# EAGLE schematic Led_panel_v2.0 (EAGLE 9.5.2)
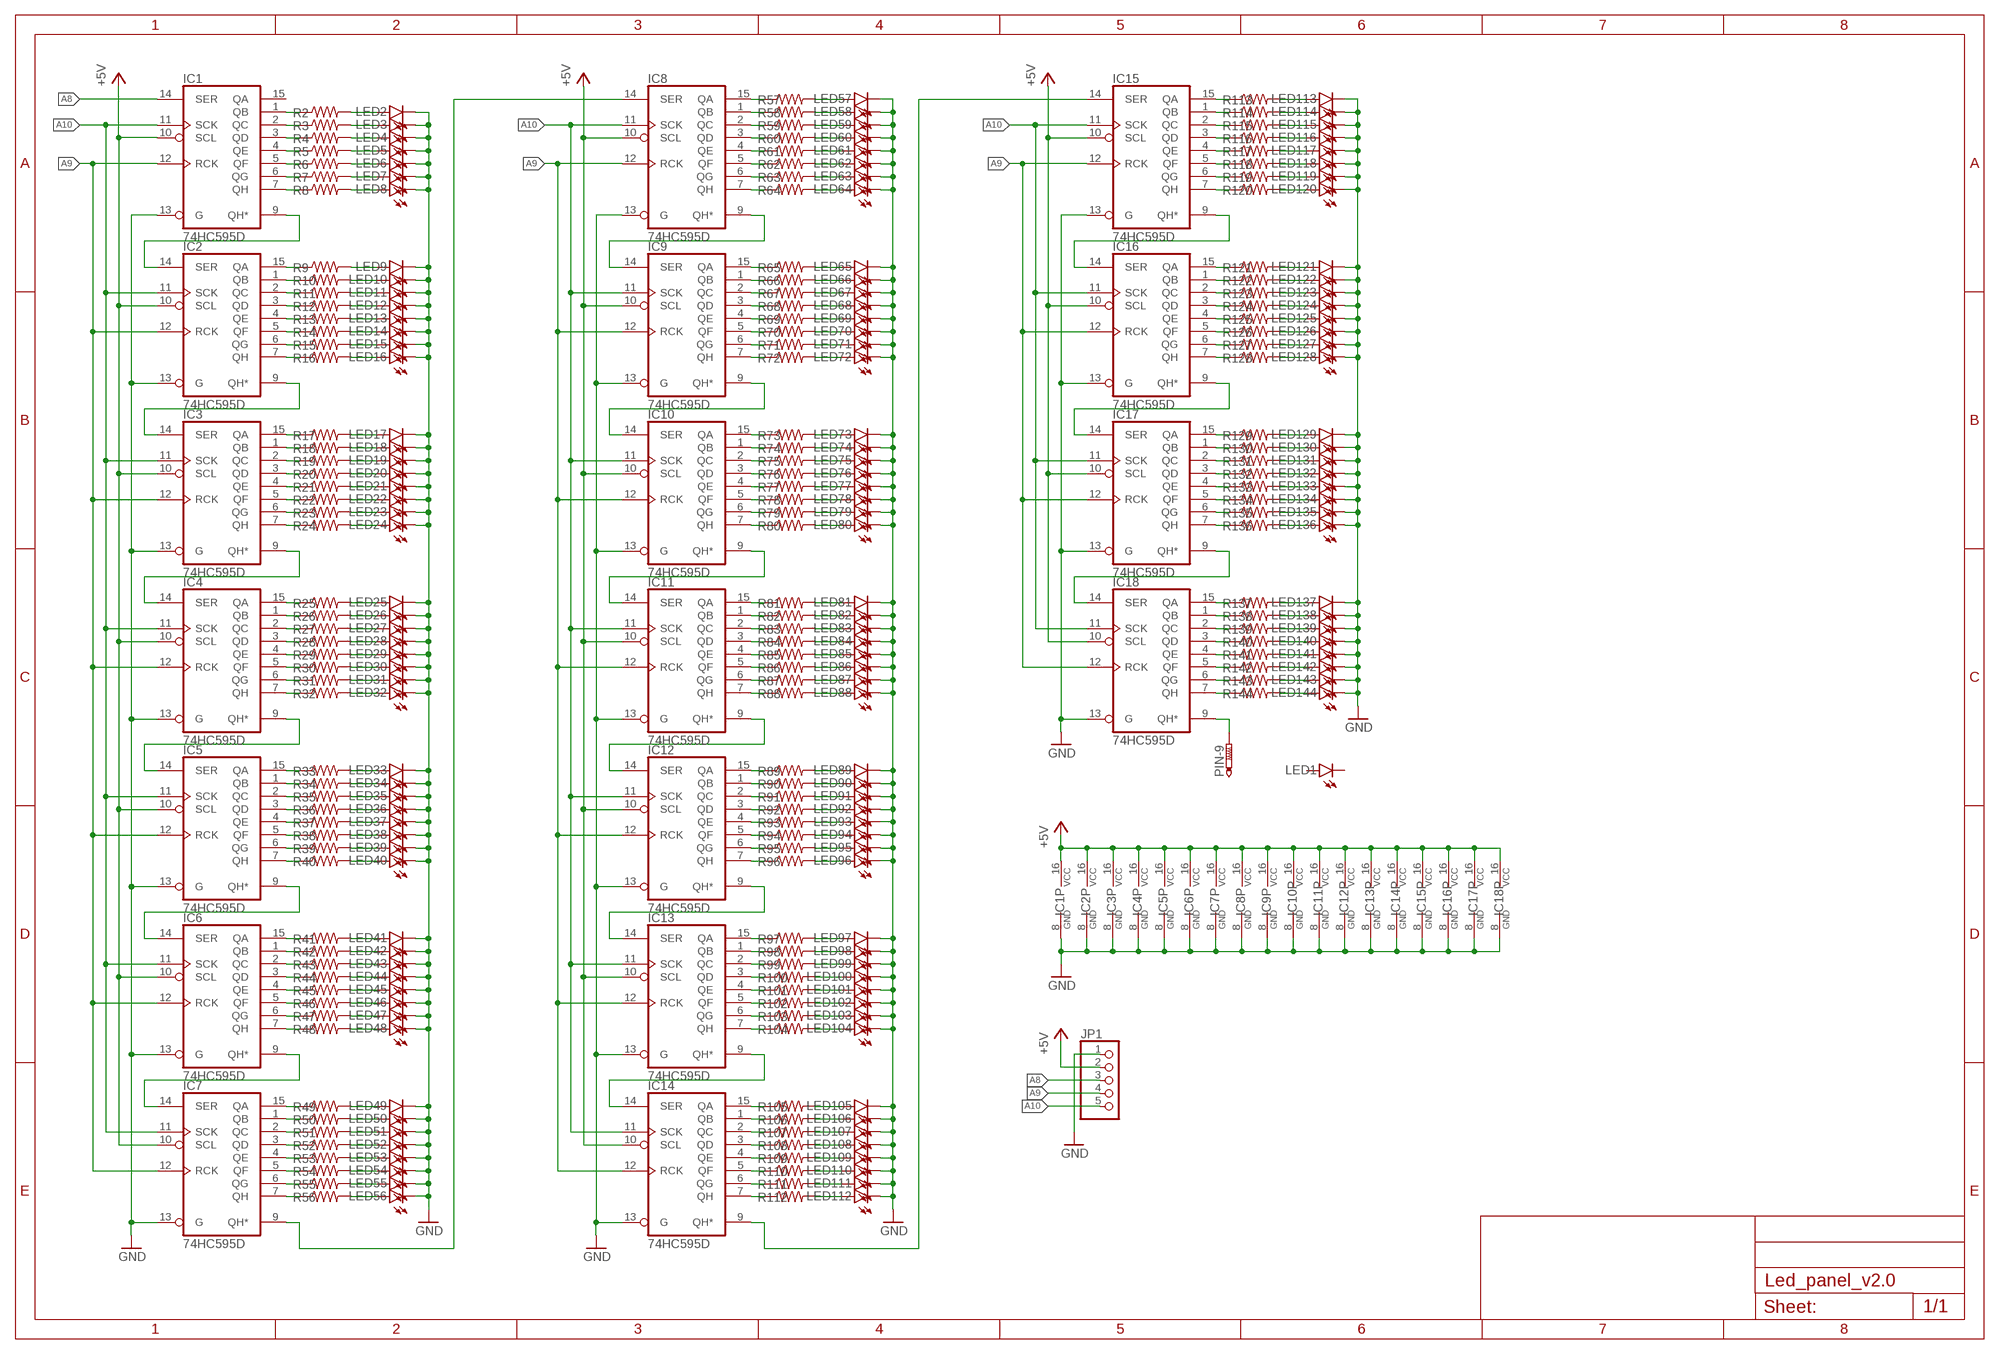
[diagram p0: schematic, sheet 1]

## Parts
IC1  74HC595D  [SO16]
IC2  74HC595D  [SO16]
IC3  74HC595D  [SO16]
IC4  74HC595D  [SO16]
IC5  74HC595D  [SO16]
IC6  74HC595D  [SO16]
IC7  74HC595D  [SO16]
IC8  74HC595D  [SO16]
IC9  74HC595D  [SO16]
IC10  74HC595D  [SO16]
IC11  74HC595D  [SO16]
IC12  74HC595D  [SO16]
IC13  74HC595D  [SO16]
IC14  74HC595D  [SO16]
IC15  74HC595D  [SO16]
IC16  74HC595D  [SO16]
IC17  74HC595D  [SO16]
IC18  74HC595D  [SO16]
JP1  PINHD-1X5  [1X05]
LED1  LED3MM  [LED3MM]
LED2  LED3MM  [LED3MM]
LED3  LED3MM  [LED3MM]
LED4  LED3MM  [LED3MM]
LED5  LED3MM  [LED3MM]
LED6  LED3MM  [LED3MM]
LED7  LED3MM  [LED3MM]
LED8  LED3MM  [LED3MM]
LED9  LED3MM  [LED3MM]
LED10  LED3MM  [LED3MM]
LED11  LED3MM  [LED3MM]
LED12  LED3MM  [LED3MM]
LED13  LED3MM  [LED3MM]
LED14  LED3MM  [LED3MM]
LED15  LED3MM  [LED3MM]
LED16  LED3MM  [LED3MM]
LED17  LED3MM  [LED3MM]
LED18  LED3MM  [LED3MM]
LED19  LED3MM  [LED3MM]
LED20  LED3MM  [LED3MM]
LED21  LED3MM  [LED3MM]
LED22  LED3MM  [LED3MM]
LED23  LED3MM  [LED3MM]
LED24  LED3MM  [LED3MM]
LED25  LED3MM  [LED3MM]
LED26  LED3MM  [LED3MM]
LED27  LED3MM  [LED3MM]
LED28  LED3MM  [LED3MM]
LED29  LED3MM  [LED3MM]
LED30  LED3MM  [LED3MM]
LED31  LED3MM  [LED3MM]
LED32  LED3MM  [LED3MM]
LED33  LED3MM  [LED3MM]
LED34  LED3MM  [LED3MM]
LED35  LED3MM  [LED3MM]
LED36  LED3MM  [LED3MM]
LED37  LED3MM  [LED3MM]
LED38  LED3MM  [LED3MM]
LED39  LED3MM  [LED3MM]
LED40  LED3MM  [LED3MM]
LED41  LED3MM  [LED3MM]
LED42  LED3MM  [LED3MM]
LED43  LED3MM  [LED3MM]
LED44  LED3MM  [LED3MM]
LED45  LED3MM  [LED3MM]
LED46  LED3MM  [LED3MM]
LED47  LED3MM  [LED3MM]
LED48  LED3MM  [LED3MM]
LED49  LED3MM  [LED3MM]
LED50  LED3MM  [LED3MM]
LED51  LED3MM  [LED3MM]
LED52  LED3MM  [LED3MM]
LED53  LED3MM  [LED3MM]
LED54  LED3MM  [LED3MM]
LED55  LED3MM  [LED3MM]
LED56  LED3MM  [LED3MM]
LED57  LED3MM  [LED3MM]
LED58  LED3MM  [LED3MM]
LED59  LED3MM  [LED3MM]
LED60  LED3MM  [LED3MM]
LED61  LED3MM  [LED3MM]
LED62  LED3MM  [LED3MM]
LED63  LED3MM  [LED3MM]
LED64  LED3MM  [LED3MM]
LED65  LED3MM  [LED3MM]
LED66  LED3MM  [LED3MM]
LED67  LED3MM  [LED3MM]
LED68  LED3MM  [LED3MM]
LED69  LED3MM  [LED3MM]
LED70  LED3MM  [LED3MM]
LED71  LED3MM  [LED3MM]
LED72  LED3MM  [LED3MM]
LED73  LED3MM  [LED3MM]
LED74  LED3MM  [LED3MM]
LED75  LED3MM  [LED3MM]
LED76  LED3MM  [LED3MM]
LED77  LED3MM  [LED3MM]
LED78  LED3MM  [LED3MM]
LED79  LED3MM  [LED3MM]
LED80  LED3MM  [LED3MM]
LED81  LED3MM  [LED3MM]
LED82  LED3MM  [LED3MM]
LED83  LED3MM  [LED3MM]
LED84  LED3MM  [LED3MM]
LED85  LED3MM  [LED3MM]
LED86  LED3MM  [LED3MM]
LED87  LED3MM  [LED3MM]
LED88  LED3MM  [LED3MM]
LED89  LED3MM  [LED3MM]
LED90  LED3MM  [LED3MM]
LED91  LED3MM  [LED3MM]
LED92  LED3MM  [LED3MM]
LED93  LED3MM  [LED3MM]
LED94  LED3MM  [LED3MM]
LED95  LED3MM  [LED3MM]
LED96  LED3MM  [LED3MM]
LED97  LED3MM  [LED3MM]
LED98  LED3MM  [LED3MM]
LED99  LED3MM  [LED3MM]
LED100  LED3MM  [LED3MM]
LED101  LED3MM  [LED3MM]
LED102  LED3MM  [LED3MM]
LED103  LED3MM  [LED3MM]
LED104  LED3MM  [LED3MM]
LED105  LED3MM  [LED3MM]
LED106  LED3MM  [LED3MM]
LED107  LED3MM  [LED3MM]
LED108  LED3MM  [LED3MM]
LED109  LED3MM  [LED3MM]
LED110  LED3MM  [LED3MM]
LED111  LED3MM  [LED3MM]
LED112  LED3MM  [LED3MM]
LED113  LED3MM  [LED3MM]
LED114  LED3MM  [LED3MM]
LED115  LED3MM  [LED3MM]
LED116  LED3MM  [LED3MM]
LED117  LED3MM  [LED3MM]
LED118  LED3MM  [LED3MM]
LED119  LED3MM  [LED3MM]
LED120  LED3MM  [LED3MM]
LED121  LED3MM  [LED3MM]
LED122  LED3MM  [LED3MM]
LED123  LED3MM  [LED3MM]
LED124  LED3MM  [LED3MM]
LED125  LED3MM  [LED3MM]
LED126  LED3MM  [LED3MM]
LED127  LED3MM  [LED3MM]
LED128  LED3MM  [LED3MM]
LED129  LED3MM  [LED3MM]
LED130  LED3MM  [LED3MM]
LED131  LED3MM  [LED3MM]
LED132  LED3MM  [LED3MM]
LED133  LED3MM  [LED3MM]
LED134  LED3MM  [LED3MM]
LED135  LED3MM  [LED3MM]
LED136  LED3MM  [LED3MM]
LED137  LED3MM  [LED3MM]
LED138  LED3MM  [LED3MM]
LED139  LED3MM  [LED3MM]
LED140  LED3MM  [LED3MM]
LED141  LED3MM  [LED3MM]
LED142  LED3MM  [LED3MM]
LED143  LED3MM  [LED3MM]
LED144  LED3MM  [LED3MM]
PIN-9  PTR1TP20R  [TP20R]
R2  120R  R-US_R0805  [R0805]
R3  120R  R-US_R0805  [R0805]
R4  120R  R-US_R0805  [R0805]
R5  120R  R-US_R0805  [R0805]
R6  120R  R-US_R0805  [R0805]
R7  120R  R-US_R0805  [R0805]
R8  120R  R-US_R0805  [R0805]
R9  120R  R-US_R0805  [R0805]
R10  120R  R-US_R0805  [R0805]
R11  120R  R-US_R0805  [R0805]
R12  120R  R-US_R0805  [R0805]
R13  120R  R-US_R0805  [R0805]
R14  120R  R-US_R0805  [R0805]
R15  120R  R-US_R0805  [R0805]
R16  120R  R-US_R0805  [R0805]
R17  120R  R-US_R0805  [R0805]
R18  120R  R-US_R0805  [R0805]
R19  120R  R-US_R0805  [R0805]
R20  120R  R-US_R0805  [R0805]
R21  120R  R-US_R0805  [R0805]
R22  120R  R-US_R0805  [R0805]
R23  120R  R-US_R0805  [R0805]
R24  120R  R-US_R0805  [R0805]
R25  120R  R-US_R0805  [R0805]
R26  120R  R-US_R0805  [R0805]
R27  120R  R-US_R0805  [R0805]
R28  120R  R-US_R0805  [R0805]
R29  120R  R-US_R0805  [R0805]
R30  120R  R-US_R0805  [R0805]
R31  120R  R-US_R0805  [R0805]
R32  120R  R-US_R0805  [R0805]
R33  120R  R-US_R0805  [R0805]
R34  120R  R-US_R0805  [R0805]
R35  120R  R-US_R0805  [R0805]
R36  120R  R-US_R0805  [R0805]
R37  120R  R-US_R0805  [R0805]
R38  120R  R-US_R0805  [R0805]
R39  120R  R-US_R0805  [R0805]
R40  120R  R-US_R0805  [R0805]
R41  120R  R-US_R0805  [R0805]
R42  120R  R-US_R0805  [R0805]
R43  120R  R-US_R0805  [R0805]
R44  120R  R-US_R0805  [R0805]
R45  120R  R-US_R0805  [R0805]
R46  120R  R-US_R0805  [R0805]
R47  120R  R-US_R0805  [R0805]
R48  120R  R-US_R0805  [R0805]
R49  120R  R-US_R0805  [R0805]
R50  120R  R-US_R0805  [R0805]
R51  120R  R-US_R0805  [R0805]
R52  120R  R-US_R0805  [R0805]
R53  120R  R-US_R0805  [R0805]
R54  120R  R-US_R0805  [R0805]
R55  120R  R-US_R0805  [R0805]
R56  120R  R-US_R0805  [R0805]
R57  120R  R-US_R0805  [R0805]
R58  120R  R-US_R0805  [R0805]
R59  120R  R-US_R0805  [R0805]
R60  120R  R-US_R0805  [R0805]
R61  120R  R-US_R0805  [R0805]
R62  120R  R-US_R0805  [R0805]
R63  120R  R-US_R0805  [R0805]
R64  120R  R-US_R0805  [R0805]
R65  120R  R-US_R0805  [R0805]
R66  120R  R-US_R0805  [R0805]
R67  120R  R-US_R0805  [R0805]
R68  120R  R-US_R0805  [R0805]
R69  120R  R-US_R0805  [R0805]
R70  120R  R-US_R0805  [R0805]
R71  120R  R-US_R0805  [R0805]
R72  120R  R-US_R0805  [R0805]
R73  120R  R-US_R0805  [R0805]
R74  120R  R-US_R0805  [R0805]
R75  120R  R-US_R0805  [R0805]
R76  120R  R-US_R0805  [R0805]
R77  120R  R-US_R0805  [R0805]
R78  120R  R-US_R0805  [R0805]
R79  120R  R-US_R0805  [R0805]
R80  120R  R-US_R0805  [R0805]
R81  120R  R-US_R0805  [R0805]
R82  120R  R-US_R0805  [R0805]
R83  120R  R-US_R0805  [R0805]
R84  120R  R-US_R0805  [R0805]
R85  120R  R-US_R0805  [R0805]
R86  120R  R-US_R0805  [R0805]
R87  120R  R-US_R0805  [R0805]
R88  120R  R-US_R0805  [R0805]
R89  120R  R-US_R0805  [R0805]
R90  120R  R-US_R0805  [R0805]
R91  120R  R-US_R0805  [R0805]
R92  120R  R-US_R0805  [R0805]
R93  120R  R-US_R0805  [R0805]
R94  120R  R-US_R0805  [R0805]
R95  120R  R-US_R0805  [R0805]
R96  120R  R-US_R0805  [R0805]
R97  120R  R-US_R0805  [R0805]
R98  120R  R-US_R0805  [R0805]
R99  120R  R-US_R0805  [R0805]
R100  120R  R-US_R0805  [R0805]
R101  120R  R-US_R0805  [R0805]
R102  120R  R-US_R0805  [R0805]
R103  120R  R-US_R0805  [R0805]
R104  120R  R-US_R0805  [R0805]
R105  120R  R-US_R0805  [R0805]
R106  120R  R-US_R0805  [R0805]
R107  120R  R-US_R0805  [R0805]
R108  120R  R-US_R0805  [R0805]
R109  120R  R-US_R0805  [R0805]
R110  120R  R-US_R0805  [R0805]
R111  120R  R-US_R0805  [R0805]
R112  120R  R-US_R0805  [R0805]
R113  120R  R-US_R0805  [R0805]
R114  120R  R-US_R0805  [R0805]
R115  120R  R-US_R0805  [R0805]
R116  120R  R-US_R0805  [R0805]
R117  120R  R-US_R0805  [R0805]
R118  120R  R-US_R0805  [R0805]
R119  120R  R-US_R0805  [R0805]
R120  120R  R-US_R0805  [R0805]
R121  120R  R-US_R0805  [R0805]
R122  120R  R-US_R0805  [R0805]
R123  120R  R-US_R0805  [R0805]
R124  120R  R-US_R0805  [R0805]
R125  120R  R-US_R0805  [R0805]
R126  120R  R-US_R0805  [R0805]
R127  120R  R-US_R0805  [R0805]
R128  120R  R-US_R0805  [R0805]
R129  120R  R-US_R0805  [R0805]
R130  120R  R-US_R0805  [R0805]
R131  120R  R-US_R0805  [R0805]
R132  120R  R-US_R0805  [R0805]
R133  120R  R-US_R0805  [R0805]
R134  120R  R-US_R0805  [R0805]
R135  120R  R-US_R0805  [R0805]
R136  120R  R-US_R0805  [R0805]
R137  120R  R-US_R0805  [R0805]
R138  120R  R-US_R0805  [R0805]
R139  120R  R-US_R0805  [R0805]
R140  120R  R-US_R0805  [R0805]
R141  120R  R-US_R0805  [R0805]
R142  120R  R-US_R0805  [R0805]
R143  120R  R-US_R0805  [R0805]
R144  120R  R-US_R0805  [R0805]

## Nets
+5V: IC1.10(SCL) IC1.16(VCC) IC2.10(SCL) IC2.16(VCC) IC3.10(SCL) IC3.16(VCC) IC4.10(SCL) IC4.16(VCC) IC5.10(SCL) IC5.16(VCC) IC6.10(SCL) IC6.16(VCC) IC7.10(SCL) IC7.16(VCC) IC8.10(SCL) IC8.16(VCC) IC9.10(SCL) IC9.16(VCC) IC10.10(SCL) IC10.16(VCC) IC11.10(SCL) IC11.16(VCC) IC12.10(SCL) IC12.16(VCC) IC13.10(SCL) IC13.16(VCC) IC14.10(SCL) IC14.16(VCC) IC15.10(SCL) IC15.16(VCC) IC16.10(SCL) IC16.16(VCC) IC17.10(SCL) IC17.16(VCC) IC18.10(SCL) IC18.16(VCC) JP1.2
A8: IC1.14(SER) JP1.3
A9: IC1.12(RCK) IC2.12(RCK) IC3.12(RCK) IC4.12(RCK) IC5.12(RCK) IC6.12(RCK) IC7.12(RCK) IC8.12(RCK) IC9.12(RCK) IC10.12(RCK) IC11.12(RCK) IC12.12(RCK) IC13.12(RCK) IC14.12(RCK) IC15.12(RCK) IC16.12(RCK) IC17.12(RCK) IC18.12(RCK) JP1.4
A10: IC1.11(SCK) IC2.11(SCK) IC3.11(SCK) IC4.11(SCK) IC5.11(SCK) IC6.11(SCK) IC7.11(SCK) IC8.11(SCK) IC9.11(SCK) IC10.11(SCK) IC11.11(SCK) IC12.11(SCK) IC13.11(SCK) IC14.11(SCK) IC15.11(SCK) IC16.11(SCK) IC17.11(SCK) IC18.11(SCK) JP1.5
GND: IC1.8(GND) IC1.13(G) IC2.8(GND) IC2.13(G) IC3.8(GND) IC3.13(G) IC4.8(GND) IC4.13(G) IC5.8(GND) IC5.13(G) IC6.8(GND) IC6.13(G) IC7.8(GND) IC7.13(G) IC8.8(GND) IC8.13(G) IC9.8(GND) IC9.13(G) IC10.8(GND) IC10.13(G) IC11.8(GND) IC11.13(G) IC12.8(GND) IC12.13(G) IC13.8(GND) IC13.13(G) IC14.8(GND) IC14.13(G) IC15.8(GND) IC15.13(G) IC16.8(GND) IC16.13(G) IC17.8(GND) IC17.13(G) IC18.8(GND) IC18.13(G) JP1.1 LED2.K(C) LED3.K(C) LED4.K(C) LED5.K(C) LED6.K(C) LED7.K(C) LED8.K(C) LED9.K(C) LED10.K(C) LED11.K(C) LED12.K(C) LED13.K(C) LED14.K(C) LED15.K(C) LED16.K(C) LED17.K(C) LED18.K(C) LED19.K(C) LED20.K(C) LED21.K(C) LED22.K(C) LED23.K(C) LED24.K(C) LED25.K(C) LED26.K(C) LED27.K(C) LED28.K(C) LED29.K(C) LED30.K(C) LED31.K(C) LED32.K(C) LED33.K(C) LED34.K(C) LED35.K(C) LED36.K(C) LED37.K(C) LED38.K(C) LED39.K(C) LED40.K(C) LED41.K(C) LED42.K(C) LED43.K(C) LED44.K(C) LED45.K(C) LED46.K(C) LED47.K(C) LED48.K(C) LED49.K(C) LED50.K(C) LED51.K(C) LED52.K(C) LED53.K(C) LED54.K(C) LED55.K(C) LED56.K(C) LED57.K(C) LED58.K(C) LED59.K(C) LED60.K(C) LED61.K(C) LED62.K(C) LED63.K(C) LED64.K(C) LED65.K(C) LED66.K(C) LED67.K(C) LED68.K(C) LED69.K(C) LED70.K(C) LED71.K(C) LED72.K(C) LED73.K(C) LED74.K(C) LED75.K(C) LED76.K(C) LED77.K(C) LED78.K(C) LED79.K(C) LED80.K(C) LED81.K(C) LED82.K(C) LED83.K(C) LED84.K(C) LED85.K(C) LED86.K(C) LED87.K(C) LED88.K(C) LED89.K(C) LED90.K(C) LED91.K(C) LED92.K(C) LED93.K(C) LED94.K(C) LED95.K(C) LED96.K(C) LED97.K(C) LED98.K(C) LED99.K(C) LED100.K(C) LED101.K(C) LED102.K(C) LED103.K(C) LED104.K(C) LED105.K(C) LED106.K(C) LED107.K(C) LED108.K(C) LED109.K(C) LED110.K(C) LED111.K(C) LED112.K(C) LED113.K(C) LED114.K(C) LED115.K(C) LED116.K(C) LED117.K(C) LED118.K(C) LED119.K(C) LED120.K(C) LED121.K(C) LED122.K(C) LED123.K(C) LED124.K(C) LED125.K(C) LED126.K(C) LED127.K(C) LED128.K(C) LED129.K(C) LED130.K(C) LED131.K(C) LED132.K(C) LED133.K(C) LED134.K(C) LED135.K(C) LED136.K(C) LED137.K(C) LED138.K(C) LED139.K(C) LED140.K(C) LED141.K(C) LED142.K(C) LED143.K(C) LED144.K(C)
N$1: IC18.9(QH*) PIN-9.TP
N$3: IC1.1(QB) R2.1
N$4: LED2.A R2.2
N$5: IC1.2(QC) R3.1
N$6: LED3.A R3.2
N$7: IC1.3(QD) R4.1
N$8: LED4.A R4.2
N$9: IC1.4(QE) R5.1
N$10: LED5.A R5.2
N$11: IC1.5(QF) R6.1
N$12: LED6.A R6.2
N$13: IC1.6(QG) R7.1
N$14: LED7.A R7.2
N$15: IC1.7(QH) R8.1
N$16: LED8.A R8.2
N$17: IC2.15(QA) R9.1
N$18: LED9.A R9.2
N$19: IC2.1(QB) R10.1
N$20: LED10.A R10.2
N$21: IC2.2(QC) R11.1
N$22: LED11.A R11.2
N$23: IC2.3(QD) R12.1
N$24: LED12.A R12.2
N$25: IC2.4(QE) R13.1
N$26: LED13.A R13.2
N$27: IC2.5(QF) R14.1
N$28: LED14.A R14.2
N$29: IC2.6(QG) R15.1
N$30: LED15.A R15.2
N$31: IC2.7(QH) R16.1
N$32: LED16.A R16.2
N$33: IC3.15(QA) R17.1
N$34: LED17.A R17.2
N$35: IC3.1(QB) R18.1
N$36: LED18.A R18.2
N$37: IC3.2(QC) R19.1
N$38: LED19.A R19.2
N$39: IC3.3(QD) R20.1
N$40: LED20.A R20.2
N$41: IC3.4(QE) R21.1
N$42: LED21.A R21.2
N$43: IC3.5(QF) R22.1
N$44: LED22.A R22.2
N$45: IC3.6(QG) R23.1
N$46: LED23.A R23.2
N$47: IC3.7(QH) R24.1
N$48: LED24.A R24.2
N$49: IC4.15(QA) R25.1
N$50: LED25.A R25.2
N$51: IC4.1(QB) R26.1
N$52: LED26.A R26.2
N$53: IC4.2(QC) R27.1
N$54: LED27.A R27.2
N$55: IC4.3(QD) R28.1
N$56: LED28.A R28.2
N$57: IC4.4(QE) R29.1
N$58: LED29.A R29.2
N$59: IC4.5(QF) R30.1
N$60: LED30.A R30.2
N$61: IC4.6(QG) R31.1
N$62: LED31.A R31.2
N$63: IC4.7(QH) R32.1
N$64: LED32.A R32.2
N$65: IC5.15(QA) R33.1
N$66: LED33.A R33.2
N$67: IC5.1(QB) R34.1
N$68: LED34.A R34.2
N$69: IC5.2(QC) R35.1
N$70: LED35.A R35.2
N$71: IC5.3(QD) R36.1
N$72: LED36.A R36.2
N$73: IC5.4(QE) R37.1
N$74: LED37.A R37.2
N$75: IC5.5(QF) R38.1
N$76: LED38.A R38.2
N$77: IC5.6(QG) R39.1
N$78: LED39.A R39.2
N$79: IC5.7(QH) R40.1
N$80: LED40.A R40.2
N$81: IC6.15(QA) R41.1
N$82: LED41.A R41.2
N$83: IC6.1(QB) R42.1
N$84: LED42.A R42.2
N$85: IC6.2(QC) R43.1
N$86: LED43.A R43.2
N$87: IC6.3(QD) R44.1
N$88: LED44.A R44.2
N$89: IC6.4(QE) R45.1
N$90: LED45.A R45.2
N$91: IC6.5(QF) R46.1
N$92: LED46.A R46.2
N$93: IC6.6(QG) R47.1
N$94: LED47.A R47.2
N$95: IC6.7(QH) R48.1
N$96: LED48.A R48.2
N$97: IC7.15(QA) R49.1
N$98: LED49.A R49.2
N$99: IC7.1(QB) R50.1
N$100: LED50.A R50.2
N$101: IC7.2(QC) R51.1
N$102: LED51.A R51.2
N$103: IC7.3(QD) R52.1
N$104: LED52.A R52.2
N$105: IC7.4(QE) R53.1
N$106: LED53.A R53.2
N$107: IC7.5(QF) R54.1
N$108: LED54.A R54.2
N$109: IC7.6(QG) R55.1
N$110: LED55.A R55.2
N$111: IC7.7(QH) R56.1
N$112: LED56.A R56.2
N$113: IC8.15(QA) R57.1
N$114: LED57.A R57.2
N$115: IC8.1(QB) R58.1
N$116: LED58.A R58.2
N$117: IC8.2(QC) R59.1
N$118: LED59.A R59.2
N$119: IC8.3(QD) R60.1
N$120: LED60.A R60.2
N$121: IC8.4(QE) R61.1
N$122: LED61.A R61.2
N$123: IC8.5(QF) R62.1
N$124: LED62.A R62.2
N$125: IC8.6(QG) R63.1
N$126: LED63.A R63.2
N$127: IC8.7(QH) R64.1
N$128: LED64.A R64.2
N$129: IC9.15(QA) R65.1
N$130: LED65.A R65.2
N$131: IC9.1(QB) R66.1
N$132: LED66.A R66.2
N$133: IC9.2(QC) R67.1
N$134: LED67.A R67.2
N$135: IC9.3(QD) R68.1
N$136: LED68.A R68.2
N$137: IC9.4(QE) R69.1
N$138: LED69.A R69.2
N$139: IC9.5(QF) R70.1
N$140: LED70.A R70.2
N$141: IC9.6(QG) R71.1
N$142: LED71.A R71.2
N$143: IC9.7(QH) R72.1
N$144: LED72.A R72.2
N$145: IC10.15(QA) R73.1
N$146: LED73.A R73.2
N$147: IC10.1(QB) R74.1
N$148: LED74.A R74.2
N$149: IC10.2(QC) R75.1
N$150: LED75.A R75.2
N$151: IC10.3(QD) R76.1
N$152: LED76.A R76.2
N$153: IC10.4(QE) R77.1
N$154: LED77.A R77.2
N$155: IC10.5(QF) R78.1
N$156: LED78.A R78.2
N$157: IC10.6(QG) R79.1
N$158: LED79.A R79.2
N$159: IC10.7(QH) R80.1
N$160: LED80.A R80.2
N$161: IC11.15(QA) R81.1
N$162: LED81.A R81.2
N$163: IC11.1(QB) R82.1
N$164: LED82.A R82.2
N$165: IC11.2(QC) R83.1
N$166: LED83.A R83.2
N$167: IC11.3(QD) R84.1
N$168: LED84.A R84.2
N$169: IC11.4(QE) R85.1
N$170: LED85.A R85.2
N$171: IC11.5(QF) R86.1
N$172: LED86.A R86.2
N$173: IC11.6(QG) R87.1
N$174: LED87.A R87.2
N$175: IC11.7(QH) R88.1
N$176: LED88.A R88.2
N$177: IC12.15(QA) R89.1
N$178: LED89.A R89.2
N$179: IC12.1(QB) R90.1
N$180: LED90.A R90.2
N$181: IC12.2(QC) R91.1
N$182: LED91.A R91.2
N$183: IC12.3(QD) R92.1
N$184: LED92.A R92.2
N$185: IC12.4(QE) R93.1
N$186: LED93.A R93.2
N$187: IC12.5(QF) R94.1
N$188: LED94.A R94.2
N$189: IC12.6(QG) R95.1
N$190: LED95.A R95.2
N$191: IC12.7(QH) R96.1
N$192: LED96.A R96.2
N$193: IC13.15(QA) R97.1
N$194: LED97.A R97.2
N$195: IC13.1(QB) R98.1
N$196: LED98.A R98.2
N$197: IC13.2(QC) R99.1
N$198: LED99.A R99.2
N$199: IC13.3(QD) R100.1
N$200: LED100.A R100.2
N$201: IC13.4(QE) R101.1
N$202: LED101.A R101.2
N$203: IC13.5(QF) R102.1
N$204: LED102.A R102.2
N$205: IC13.6(QG) R103.1
N$206: LED103.A R103.2
N$207: IC13.7(QH) R104.1
N$208: LED104.A R104.2
N$209: IC14.15(QA) R105.1
N$210: LED105.A R105.2
N$211: IC14.1(QB) R106.1
N$212: LED106.A R106.2
N$213: IC14.2(QC) R107.1
N$214: LED107.A R107.2
N$215: IC14.3(QD) R108.1
N$216: LED108.A R108.2
N$217: IC14.4(QE) R109.1
N$218: LED109.A R109.2
N$219: IC14.5(QF) R110.1
N$220: LED110.A R110.2
N$221: IC14.6(QG) R111.1
N$222: LED111.A R111.2
N$223: IC14.7(QH) R112.1
N$224: LED112.A R112.2
N$225: IC15.15(QA) R113.1
N$226: LED113.A R113.2
N$227: IC15.1(QB) R114.1
N$228: LED114.A R114.2
N$229: IC15.2(QC) R115.1
N$230: LED115.A R115.2
N$231: IC15.3(QD) R116.1
N$232: LED116.A R116.2
N$233: IC15.4(QE) R117.1
N$234: LED117.A R117.2
N$235: IC15.5(QF) R118.1
N$236: LED118.A R118.2
N$237: IC15.6(QG) R119.1
N$238: LED119.A R119.2
N$239: IC15.7(QH) R120.1
N$240: LED120.A R120.2
N$241: IC16.15(QA) R121.1
N$242: LED121.A R121.2
N$243: IC16.1(QB) R122.1
N$244: LED122.A R122.2
N$245: IC16.2(QC) R123.1
N$246: LED123.A R123.2
N$247: IC16.3(QD) R124.1
N$248: LED124.A R124.2
N$249: IC16.4(QE) R125.1
N$250: LED125.A R125.2
N$251: IC16.5(QF) R126.1
N$252: LED126.A R126.2
N$253: IC16.6(QG) R127.1
N$254: LED127.A R127.2
N$255: IC16.7(QH) R128.1
N$256: LED128.A R128.2
N$257: IC17.15(QA) R129.1
N$258: LED129.A R129.2
N$259: IC17.1(QB) R130.1
N$260: LED130.A R130.2
N$261: IC17.2(QC) R131.1
N$262: LED131.A R131.2
N$263: IC17.3(QD) R132.1
N$264: LED132.A R132.2
N$265: IC17.4(QE) R133.1
N$266: LED133.A R133.2
N$267: IC17.5(QF) R134.1
N$268: LED134.A R134.2
N$269: IC17.6(QG) R135.1
N$270: LED135.A R135.2
N$271: IC17.7(QH) R136.1
N$272: LED136.A R136.2
N$273: IC18.15(QA) R137.1
N$274: LED137.A R137.2
N$275: IC18.1(QB) R138.1
N$276: LED138.A R138.2
N$277: IC18.2(QC) R139.1
N$278: LED139.A R139.2
N$279: IC18.3(QD) R140.1
N$280: LED140.A R140.2
N$281: IC18.4(QE) R141.1
N$282: LED141.A R141.2
N$283: IC18.5(QF) R142.1
N$284: LED142.A R142.2
N$285: IC18.6(QG) R143.1
N$286: LED143.A R143.2
N$287: IC18.7(QH) R144.1
N$288: LED144.A R144.2
N$289: IC1.9(QH*) IC2.14(SER)
N$290: IC2.9(QH*) IC3.14(SER)
N$291: IC3.9(QH*) IC4.14(SER)
N$292: IC4.9(QH*) IC5.14(SER)
N$293: IC5.9(QH*) IC6.14(SER)
N$294: IC6.9(QH*) IC7.14(SER)
N$295: IC7.9(QH*) IC8.14(SER)
N$296: IC8.9(QH*) IC9.14(SER)
N$297: IC9.9(QH*) IC10.14(SER)
N$298: IC10.9(QH*) IC11.14(SER)
N$299: IC11.9(QH*) IC12.14(SER)
N$300: IC12.9(QH*) IC13.14(SER)
N$301: IC13.9(QH*) IC14.14(SER)
N$302: IC14.9(QH*) IC15.14(SER)
N$303: IC15.9(QH*) IC16.14(SER)
N$304: IC16.9(QH*) IC17.14(SER)
N$305: IC17.9(QH*) IC18.14(SER)
Unconnected: IC1.15(QA) LED1.A LED1.K(C)

## Library data of the parts
IC1-IC18 = 74xx-eu:74*595: 8-bit SHIFT REGISTER, output latch
JP1 = pinhead:PINHD-1X5: PIN HEADER
LED1-LED144 = led:LED: LED OSRAM: - CHIPLED LG R971, LG N971, LY N971, LG Q971, LY Q971, LO R971, LY R971 LH N974, LH R974 LS Q976, LO Q976, LY Q976 LO Q996 - Hyper CHIPLED LW Q18S LB Q993, LB Q99A, LB R99A - SideLED LS A670, LO A670, LY A670, LG A670, LP A670 LB A673, LV A673, LT A673, LW A673 LH A674 LY A675 LS A676, LA A676, LO A676, LY A676, LW A676 LS A679, LY A679, LG A679 - Hyper Micro SIDELED® LS Y876, LA Y876, LO Y876, LY Y876 LT Y87S - SmartLED LW L88C, LW L88S LB L89C, LB L89S, LG L890 LS L89K, LO L89K, LY L89K LS L896, LA L896, LO L896, LY L896 - TOPLED LS T670, LO T670, LY T670, LG T670, LP T670 LSG T670, LSP T670, LSY T670, LOP T670, LYG T670 LG T671, LOG T671, LSG T671 LB T673, LV T673, LT T673, LW T673 LH T674 LS T676, LA T676, LO T676, LY T676, LB T676, LH T676, LSB T676, LW T676 LB T67C, LV T67C, LT T67C, LS T67K, LO T67K, LY T67K, LW E67C LS E67B, LA E67B, LO E67B, LY E67B, LB E67C, LV E67C, LT E67C LW T67C LS T679, LY T679, LG T679 LS T770, LO T770, LY T770, LG T770, LP T770 LB T773, LV T773, LT T773, LW T773 LH T774 LS E675, LA E675, LY E675, LS T675 LS T776, LA T776, LO T776, LY T776, LB T776 LHGB T686 LT T68C, LB T68C - Hyper Mini TOPLED® LB M676 - Mini TOPLED Santana® LG M470 LS M47K, LO M47K, LY M47K Source: http://www.osram.convergy.de LUXEON: - LUMILED® LXK2-PW12-R00, LXK2-PW12-S00, LXK2-PW14-U00, LXK2-PW14-V00 LXK2-PM12-R00, LXK2-PM12-S00, LXK2-PM14-U00 LXK2-PE12-Q00, LXK2-PE12-R00, LXK2-PE12-S00, LXK2-PE14-T00, LXK2-PE14-U00 LXK2-PB12-K00, LXK2-PB12-L00, LXK2-PB12-M00, LXK2-PB14-N00, LXK2-PB14-P00, LXK2-PB14-Q00 LXK2-PR12-L00, LXK2-PR12-M00, LXK2-PR14-Q00, LXK2-PR14-R00 LXK2-PD12-Q00, LXK2-PD12-R00, LXK2-PD12-S00 LXK2-PH12-R00, LXK2-PH12-S00 LXK2-PL12-P00, LXK2-PL12-Q00, LXK2-PL12-R00 Source: www.luxeon.com KINGBRIGHT: KA-3528ASYC Source: www.kingbright.com
PIN-9 = testpad:PTR1: TEST PIN
R2-R144 = rcl:R-US_: RESISTOR, American symbol; SPICEPREFIX: R